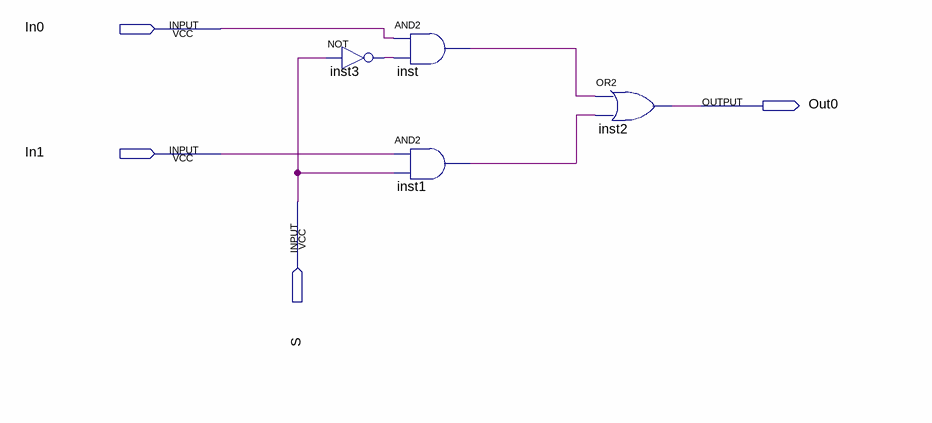
[diagram p0: schematic sheet]
// Quartus schematic mux2to1_top.bdf as structural Verilog: 4 symbols, 4 pins
module mux2to1_top (
  input  In0,
  input  In1,
  input  S,
  output Out0
);

  wire inst1_out, inst3_out, inst_out;

  not inst3 (inst3_out, S);
  and inst (inst_out, In0, inst3_out);
  and inst1 (inst1_out, In1, S);
  or inst2 (Out0, inst_out, inst1_out);
endmodule
